# EAGLE design helicopter (EAGLE 5.06)
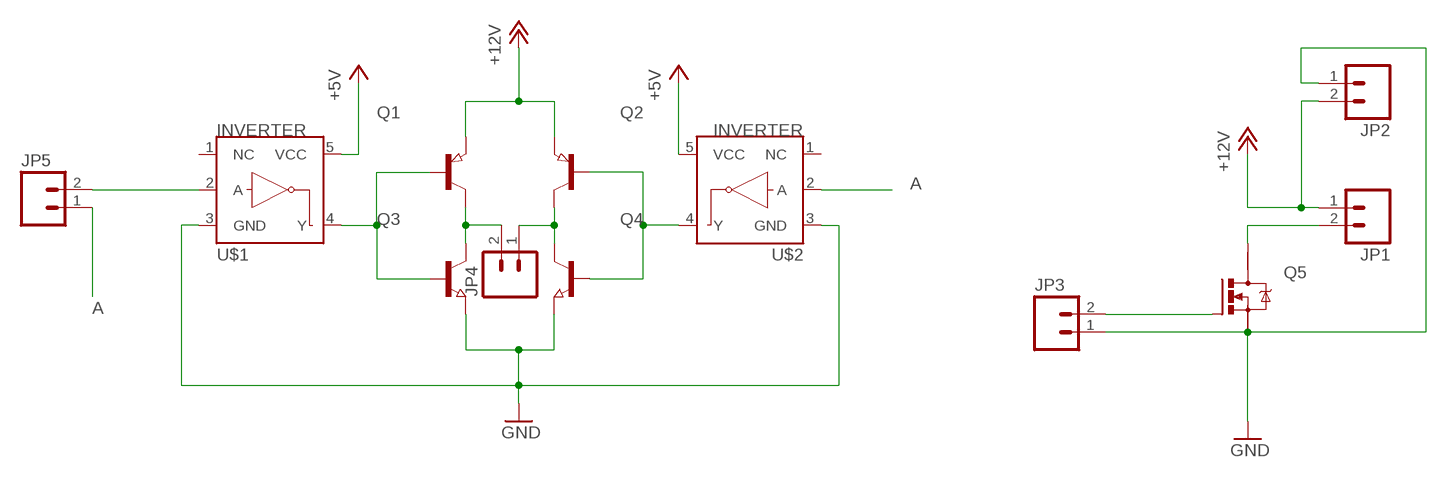
[diagram p0: schematic, sheet 1]

## Parts
JP1  M02PTH  [1X02]
JP2  M02PTH  [1X02]
JP3  M02PTH  [1X02]
JP4  M02PTH  [1X02]
JP5  M02PTH  [1X02]
Q1  PNP-TRANSISTOR_SOT23  [SOT23]
Q2  PNP-TRANSISTOR_SOT23  [SOT23]
Q3  NPN-TRANSISTOR_SOT23  [SOT23]
Q4  NPN-TRANSISTOR_SOT23  [SOT23]
Q5  N-MOSFET-SO8S  [SO-08]
U$1  INVERTER  [SOT23-5]
U$2  INVERTER  [SOT23-5]

## Nets
+5V: U$1.5(VCC) U$2.5(VCC)
+12V: JP1.1 JP2.2 Q1.2(E) Q2.2(E)
A: JP5.1 U$2.2(A)
GND: JP2.1 JP3.1 Q3.2(E) Q4.2(E) Q5.1(S) U$1.3(GND) U$2.3(GND)
M1: JP1.2 Q5.5(D)
N$1: JP5.2 U$1.2(A)
N$2: JP3.2 Q5.4(G)
N$4: JP4.2 Q1.3(C) Q3.3(C)
N$5: JP4.1 Q2.3(C) Q4.3(C)
N$6: Q2.1(B) Q4.1(B) U$2.4(Y)
N$10: Q1.1(B) Q3.1(B) U$1.4(Y)
Unconnected: Q5.2(S) Q5.3(S) Q5.6(D) Q5.7(D) Q5.8(D) U$1.1(NC) U$2.1(NC)

## Library data of the parts
JP1-JP5 = SparkFun:M02: Header 2 Standard 2-pin 0.1" header. Use with straight break away headers (SKU : PRT-00116), right angle break away headers (PRT-00553), swiss pins (PRT-00743), machine pins (PRT-00117), and female headers (PRT-00115). Molex polarized connector foot print use with SKU : PRT-08233 with associated crimp pins and housings.
Q1 Q2 = semicon-smd-ipc:PNP-TRANSISTOR_: PNP TRANSISTOR
Q3 Q4 = semicon-smd-ipc:NPN-TRANSISTOR_: NPN TRANSISTOR
Q5 = transistor-power:N-MOSFET-SO8: N-Channel MOSFET Example: FDS7760A; N-Channel Logic Level PowerTrench® MOSFET FDS2572; N-Channel UltraFET® Trench MOSFET Source: www.fairchildsemi.com
U$1 U$2 = SparkFun:INVERTER: Single inverter, SOT23-5

## Board
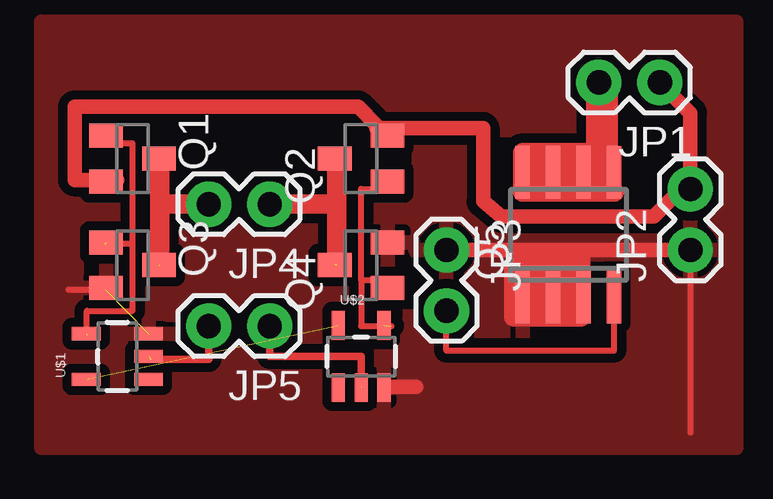
[diagram p1: board, top side]

No outline drawn. Coordinates in mm, seen from the top.
Copper layers (1*16): Top 0.035mm / dielectric 1.5mm / Bottom 0.035mm
Design rules "default *": minimum track width 10mil, minimum drill 24mil, track to track 15mil, track to pad 15mil, pad to pad 8mil, via to via 8mil, smd to smd 8mil, copper to edge 40mil, drill to drill 8mil, minimum pad ring 10mil, minimum via ring 8mil, stop-mask expansion 4mil, vias tented up to drill 0mil, thermal gap 10mil

### Footprints (pad centres in the part's own frame; a part is rotated, then mirrored left to right if it is on the bottom)
1X02 = drill 1.016 pad 1.88 round: 1 0,0; 2 2.54,0
SOT23 = smd 1 x 1.4: 1 -0.95,-1.1; 2 0.95,-1.1; 3 0,1.1
SO-08 = smd 0.6 x 2.2: 1 -1.905,-2.6; 2 -0.635,-2.6; 3 0.635,-2.6; 4 1.905,-2.6; 5 1.905,2.6; 6 0.635,2.6; 7 -0.635,2.6; 8 -1.905,2.6
SOT23-5 = smd 0.55 x 1.2: 1 -0.95,-1.3; 2 0,-1.3; 3 0.95,-1.3; 4 0.95,1.3; 5 -0.95,1.3

### Placement (x,y rotation side)
JP1  26.04,15.88 180 top
JP2  27.3,8.89 90 top
JP3  17.14,8.89 270 top
JP4  9.78,10.79 180 top
JP5  9.78,5.71 180 top
Q1  4.06,12.7 270 top
Q2  13.59,12.7 90 top
Q3  4.06,8.26 270 top
Q4  13.59,8.26 90 top
Q5  22.23,9.53 0 top
U$1  3.43,4.45 90 top
U$2  13.59,4.45 0 top

### Tracks (layer width: path | path; a pad name or v marks a point on that pad's centre or on a via)
+5V  (1 unrouted)
+12V
  Top 0.254: 14.22,14.1 14.22,13.97 Q2.2 | 3.43,11.81 Q1.2
  Top 0.61: JP1.1 27.3,14.61 JP2.2 26.92,11.43 25.78,10.29 19.43,10.29 18.67,10.92 18.67,13.97 14.22,13.97 | 3.43,11.81 1.65,11.81 1.65,14.86 13.46,14.86 14.22,14.1
A  (1 unrouted)
  Top 0.305: JP5.1 9.78,4.45 13.59,4.45 13.59,3.17
GND  (1 unrouted)
  Top 0.254: JP2.1 27.3,1.27 | 19.94,7.62 20.32,7.62 Q5.1 | 1.4,7.24 2.92,7.24
  Top 0.61: JP3.1 20.32,8.89 | 20.32,8.89 JP2.1 | 20.32,8.89 20.32,7.62 20.32,6.99 | 14.61,3.17 15.88,3.17
  Top 0.813: 22.73,8.64 22.73,6.1 19.94,6.1 19.94,7.62 19.94,8.26 22.1,8.26 22.1,6.1 20.83,6.1 20.83,7.75 21.21,7.75 21.21,6.35
  pour Top: 0.25,18.41 0.25,0.64 29.21,0.64 29.21,18.41
M1
  Top 0.254: 23.75,12.7 24.13,12.7 Q5.5
  Top 0.61: 24.13,12.06 Q5.5 23.5,12.95 JP1.2
  Top 0.813: 24.13,11.3 20.32,11.3 20.32,12.95 23.75,12.95 | 23.75,12.95 23.88,12.95 | 23.75,12.95 23.75,12.7 23.75,11.94 20.7,11.94 20.7,12.32 23.24,12.32 23.24,12.45 23.37,12.45 23.37,16 23.88,16 23.88,13.08
N$1  (1 unrouted)
  Top 0.305: 4.83,4.32 7.24,4.32 JP5.2
N$2
  Top 0.254: JP3.2 17.14,4.7 24.13,4.7 Q5.4
N$4  (1 unrouted)
  Top 0.254: 5.21,12.7 Q1.3 4.7,12.7
  Top 0.305: 5.21,8.26 5.08,8.26
  Top 0.813: 5.21,10.79 JP4.2 | 5.21,8.26 5.21,10.79 | 5.21,10.79 5.21,12.7
N$5  (1 unrouted)
  Top 0.254: 12.45,12.7 Q2.3 12.57,12.7
  Top 0.813: 12.57,10.79 12.57,8.26 | 12.57,10.79 12.57,12.7 | JP4.1 12.57,10.79
N$6  (1 unrouted)
  Top 0.254: 14.86,5.71 13.59,5.71 13.59,7.62 | 13.59,7.62 14.22,7.62 Q4.1 | 13.59,7.62 13.59,11.43 14.22,11.43 Q2.1
N$10  (2 unrouted)
  Top 0.254: 1.65,5.33 2.16,5.33 2.16,6.35 4.06,6.35 4.06,9.14 | 4.06,9.14 4.06,13.34 3.56,13.34 Q1.1 | 4.06,9.14 2.92,9.14